# Altium schematic sheet USB.SchDoc
size A
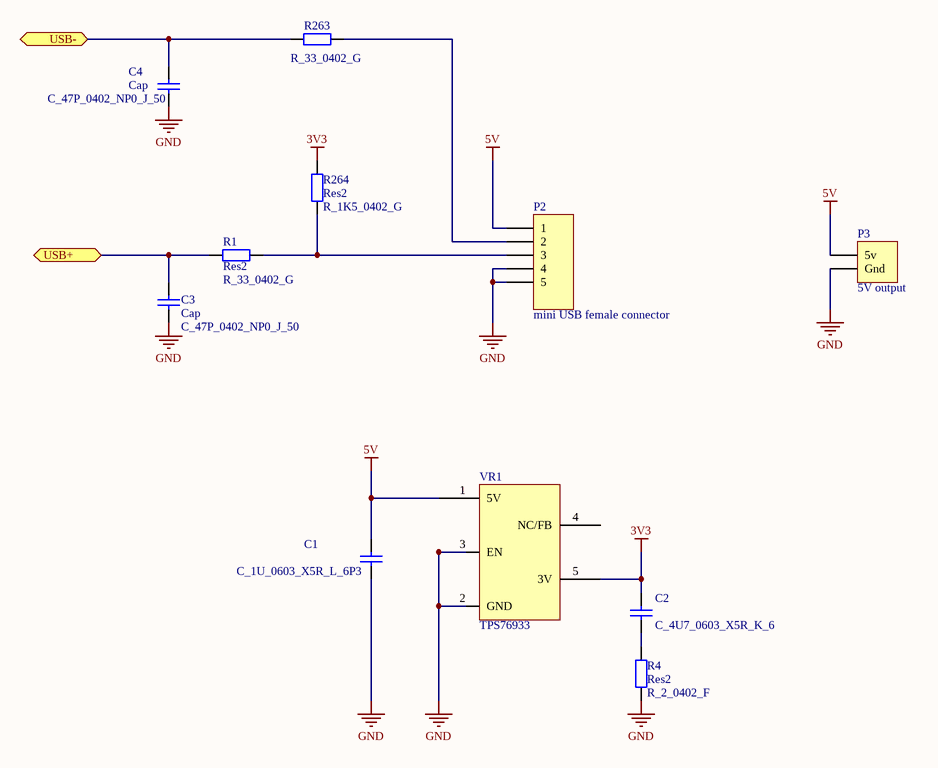
[diagram p0: USB.SchDoc]

## Parts
C1  value C_1U_0603_X5R_L_6P3  [C_0603]  (hidden comment: Cap)
C2  value C_4U7_0603_X5R_K_6  [C_0603]  (hidden comment: Cap)
C3  Cap  value C_47P_0402_NP0_J_50  [C_0402]
C4  Cap  value C_47P_0402_NP0_J_50  [C_0402]
P2  mini USB female connector  [MicroUSB10118193]
P3  5V output  [Charger Board Connector Female]
R1  Res2  value R_33_0402_G  [R_0402]
R4  Res2  value R_2_0402_F  [R_0402]
R263  value R_33_0402_G  [R_0402]  (hidden comment: Res2)
R264  Res2  value R_1K5_0402_G  [R_0402]
VR1  TPS76933  [TPS76933]

## Ports
USB+, USB-

## Nets
3V3: C2.1 R264.1 VR1.5(3V)
5V: C1.1 P2.1 P3.2(5v) VR1.1(5V)
GND: C1.2 C3.1 C4.1 P2.4 P2.5 P3.3(Gnd) R4.1 VR1.2(GND) VR1.3(EN)
USB+: C3.2 R1.1 ; port USB+
USB-: C4.2 R263.2 ; port USB-
NetC2_2: C2.2 R4.2
NetP2_2: P2.2 R263.1
NetP2_3: P2.3 R1.2 R264.2

Not connected (* = marked no-connect by the designer): VR1 4(NC/FB)

## Library data of the parts
C1-C4 = Cap: Capacitor; Published: 8-Jun-2000; LatestRevisionDate: 17-Jul-2002; LatestRevisionNote: Re-released for DXP Platform.; Publisher: Altium Limited; Supplier 1: Digi-Key
  C1: Supplier Part Number 1: 311-1372-6-ND; Supplier 2: Mouser; Supplier Part Number 2: 603-CC603ZRY5V7BB105
  C2: Supplier Part Number 1: 399-3482-6-ND
  C3 C4: Supplier Part Number 1: 311-1021-6-ND
P2 = Header 6: USB connector; LatestRevisionDate: 17-Jul-2002; LatestRevisionNote: Re-released for DXP Platform.; Publisher: Altium Limited; Supplier 1: Digi-Key; Supplier Part Number 1: 609-4616-1-ND
P3 = Header 2: 5V output to charge BrewBit; LatestRevisionDate: 17-Jul-2002; LatestRevisionNote: Re-released for DXP Platform.; Publisher: Altium Limited
R1 R4 R263 R264 = Res2: Resistor; Published: 8-Jun-2000; LatestRevisionDate: 17-Jul-2002; LatestRevisionNote: Re-released for DXP Platform.; PackageReference: AXIAL-0.4; Publisher: Altium Limited; PackageDescription: Axial Device, Thru-Hole; 2 Leads; 0.4 in Pin Spacing; Supplier 1: Digi-Key
  R1: Supplier Part Number 1: 311-33JRDKR-ND; Supplier 2: Newark; Supplier Part Number 2: 68R0002; Supplier 3: Mouser; Supplier Part Number 3: 603-RC0402JR-0733RL
  R4: Supplier Part Number 1: 311-2.0JRDKR-ND; Supplier 2: Mouser; Supplier Part Number 2: 603-RC0402JR-072RL
  R263: Supplier Part Number 1: 311-33JRDKR-ND
  R264: Supplier Part Number 1: 311-1.5KJRDKR-ND
VR1 = TPS76933: IC REG LDO 3.3V .1A SOT-23-5; Supplier 1: Digi-Key; Supplier Part Number 1: 296-11039-1-ND